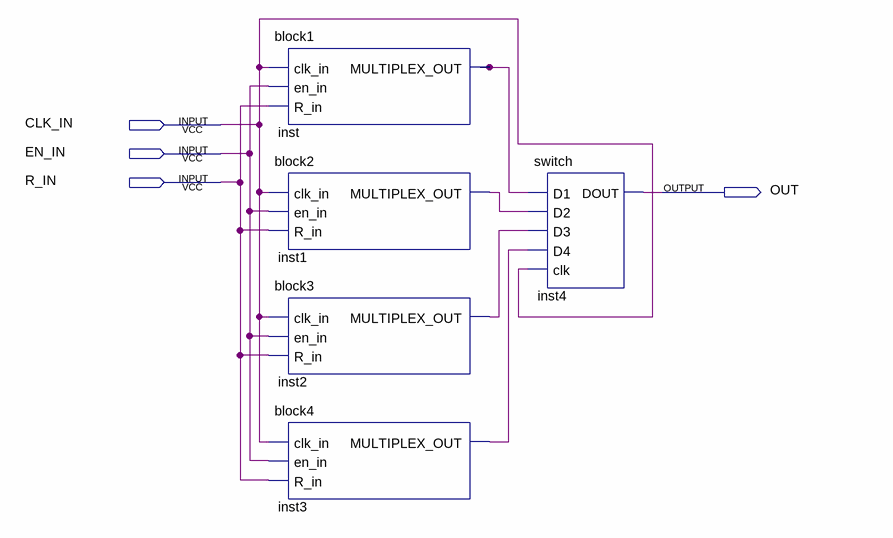
[diagram p0: schematic sheet]
// Quartus schematic IMITATOR.bdf as structural Verilog: 5 symbols, 4 pins
module IMITATOR (
  input  CLK_IN,
  input  EN_IN,
  input  R_IN,
  output OUT
);

  wire inst1_multiplex_out, inst2_multiplex_out, inst3_multiplex_out, inst_multiplex_out;

  block1 inst (.clk_in(CLK_IN), .en_in(EN_IN), .R_in(R_IN), .MULTIPLEX_OUT(inst_multiplex_out));
  block2 inst1 (.clk_in(CLK_IN), .en_in(EN_IN), .R_in(R_IN), .MULTIPLEX_OUT(inst1_multiplex_out));
  block3 inst2 (.clk_in(CLK_IN), .en_in(EN_IN), .R_in(R_IN), .MULTIPLEX_OUT(inst2_multiplex_out));
  block4 inst3 (.clk_in(CLK_IN), .en_in(EN_IN), .R_in(R_IN), .MULTIPLEX_OUT(inst3_multiplex_out));
  switch inst4 (
    .D1(inst_multiplex_out), .D2(inst1_multiplex_out), .D3(inst2_multiplex_out), .D4(inst3_multiplex_out),
    .clk(CLK_IN), .DOUT(OUT));
endmodule
